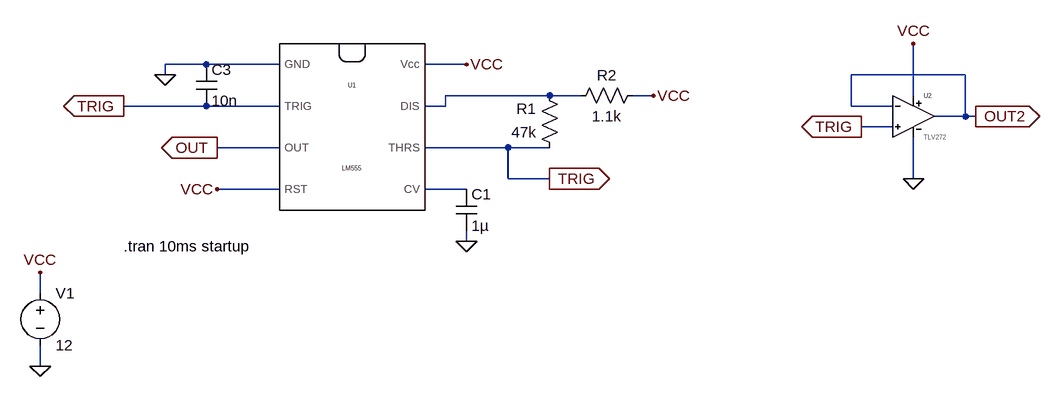
[diagram p0: schematic Draft1.asc]
Draft1.asc, the LTspice schematic file:
Version 4
SHEET 1 1364 948
WIRE 48 80 -16 80
WIRE 160 80 48 80
WIRE 448 80 384 80
WIRE -16 96 -16 80
WIRE 1216 96 1040 96
WIRE 576 128 416 128
WIRE 624 128 576 128
WIRE 736 128 704 128
WIRE 1136 128 1136 48
WIRE 48 144 -80 144
WIRE 160 144 48 144
WIRE 416 144 416 128
WIRE 416 144 384 144
WIRE 1040 144 1040 96
WIRE 1104 144 1040 144
WIRE 1216 160 1216 96
WIRE 1216 160 1168 160
WIRE 1232 160 1216 160
WIRE 1104 176 1056 176
WIRE 160 208 64 208
WIRE 512 208 384 208
WIRE 576 208 512 208
WIRE 512 256 512 208
WIRE 576 256 512 256
WIRE 1136 256 1136 192
WIRE 160 272 64 272
WIRE 448 272 384 272
WIRE 448 352 448 336
WIRE -208 432 -208 400
WIRE -208 544 -208 512
FLAG -208 400 VCC
FLAG -208 544 0
FLAG 64 208 OUT
IOPIN 64 208 Out
FLAG 64 272 VCC
FLAG 736 128 VCC
FLAG 448 80 VCC
FLAG 448 352 0
FLAG -16 96 0
FLAG -80 144 TRIG
IOPIN -80 144 Out
FLAG 1136 48 VCC
FLAG 1232 160 OUT2
IOPIN 1232 160 Out
FLAG 1136 256 0
FLAG 576 256 TRIG
IOPIN 576 256 Out
FLAG 1056 176 TRIG
IOPIN 1056 176 Out
SYMBOL LM555 272 176 R0
SYMATTR InstName U1
SYMBOL voltage -208 416 R0
WINDOW 123 0 0 Left 2
WINDOW 39 0 0 Left 2
SYMATTR InstName V1
SYMATTR Value 12
SYMBOL TLV272 1136 160 R0
SYMATTR InstName U2
SYMBOL cap 432 272 R0
SYMATTR InstName C1
SYMATTR Value 1µ
SYMBOL res 592 224 R180
WINDOW 0 36 76 Left 2
WINDOW 3 36 40 Left 2
SYMATTR InstName R1
SYMATTR Value 47k
SYMBOL res 720 112 R90
WINDOW 0 0 56 VBottom 2
WINDOW 3 32 56 VTop 2
SYMATTR InstName R2
SYMATTR Value 1.1k
SYMBOL cap 32 80 R0
SYMATTR InstName C3
SYMATTR Value 10n
TEXT -80 360 Left 2 !.tran 10ms startup

The netlist it stands for:
* Draft1.asc
XU1 0 TRIG OUT VCC N002 TRIG N001 VCC NE555  ; pins GND TRIG OUT RST CV THRS DIS Vcc
V1 VCC 0 12
XU2 TRIG OUT2 VCC 0 OUT2 level.2 Avol=1Meg GBW=3Meg Slew=2.4Meg ilimit=20m rail=0.1 Vos=0 phimargin=45 en=0 enk=0 in=0 ink=0 Rin=500Meg  ; pins In+ In- V+ V- OUT
C1 N002 0 1µ
R1 TRIG N001 47k
R2 VCC N001 1.1k
C3 0 TRIG 10n
.tran 10ms startup
.lib NE555.sub
.lib UniversalOpamps2.sub
.backanno
.end

* Results of the author's LTspice run, read from the files saved beside the schematic
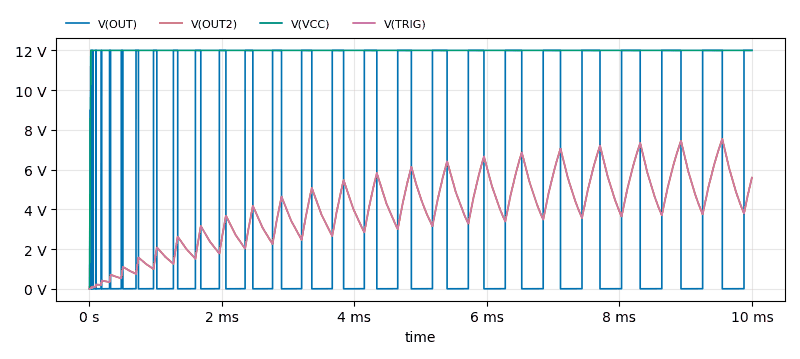
[diagram p1: Transient Analysis of Draft1.asc, plotted from the saved traces]
* Transient Analysis, 1 run:
*   V(OUT): min 0 V, max 12 V, average 4.306 V, rms 7.188 V, last 12 V
*   V(OUT2): min 0 V, max 7.545 V, average 4.035 V, rms 4.419 V, last 5.592 V
*   V(VCC): min 0 V, max 12 V, average 11.99 V, rms 11.99 V, last 12 V
*   V(TRIG): min 0 V, max 7.545 V, average 4.035 V, rms 4.419 V, last 5.593 V